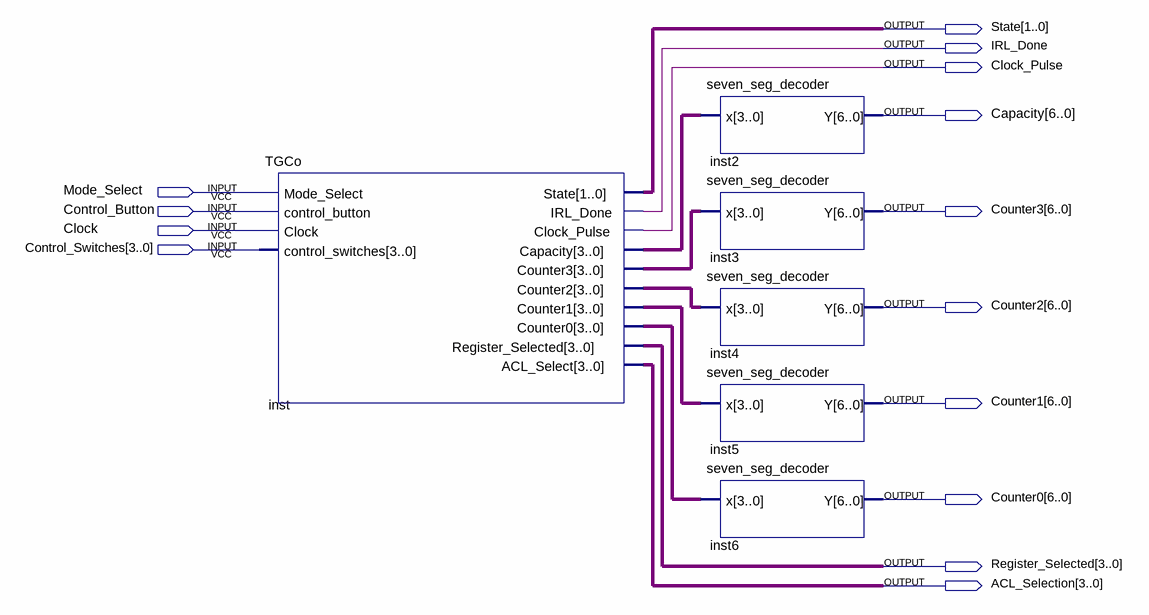
[diagram p0: schematic sheet]
// Quartus schematic FPM.bdf as structural Verilog: 6 symbols, 14 pins
module FPM (
  input  Mode_Select,
  input  Control_Button,
  input  Clock,
  input  [3:0] Control_Switches,
  output [1:0] State,
  output IRL_Done,
  output Clock_Pulse,
  output [6:0] Capacity,
  output [6:0] Counter3,
  output [6:0] Counter2,
  output [6:0] Counter1,
  output [6:0] Counter0,
  output [3:0] Register_Selected,
  output [3:0] ACL_Selection
);

  wire [3:0] inst_capacity, inst_counter0, inst_counter1, inst_counter2, inst_counter3;

  TGCo inst (
    .Mode_Select(Mode_Select), .control_button(Control_Button), .Clock(Clock),
    .control_switches(Control_Switches), .State(State), .IRL_Done(IRL_Done), .Clock_Pulse(Clock_Pulse),
    .Capacity(inst_capacity), .Counter3(inst_counter3), .Counter2(inst_counter2), .Counter1(inst_counter1),
    .Counter0(inst_counter0), .Register_Selected(Register_Selected), .ACL_Select(ACL_Selection));
  seven_seg_decoder inst2 (.x(inst_capacity), .Y(Capacity));
  seven_seg_decoder inst3 (.x(inst_counter3), .Y(Counter3));
  seven_seg_decoder inst4 (.x(inst_counter2), .Y(Counter2));
  seven_seg_decoder inst5 (.x(inst_counter1), .Y(Counter1));
  seven_seg_decoder inst6 (.x(inst_counter0), .Y(Counter0));
endmodule
